# EAGLE design BPSD (EAGLE 9.2.2)
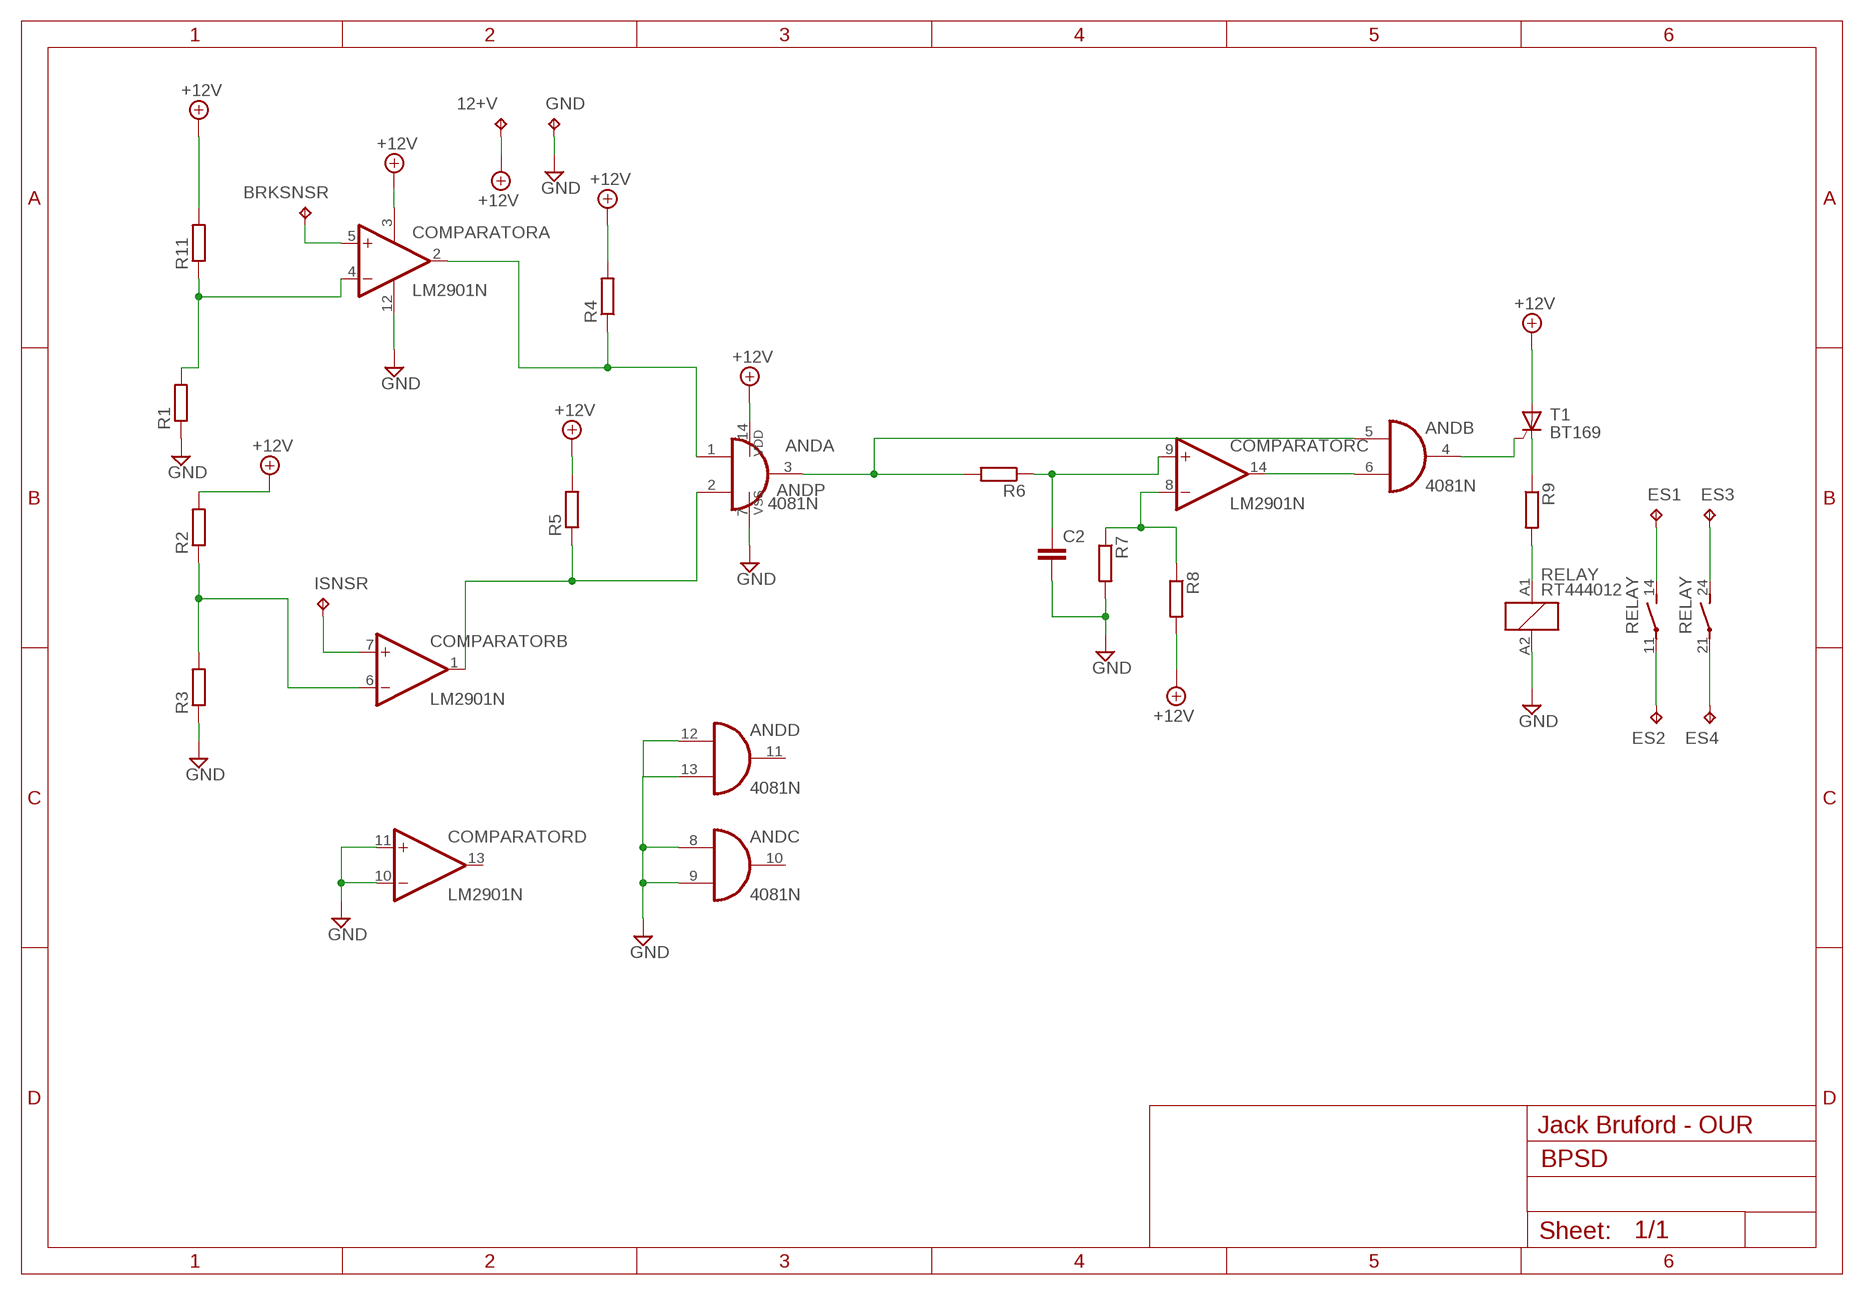
[diagram p0: schematic, sheet 1]

## Parts
12+V  TPPAD1-13  [P1-13]
AND  4081N  [DIL14]
BRKSNSR  TPPAD1-13  [P1-13]
C2  C-EU050-024X044  [C050-024X044]
COMPARATOR  LM2901N  [DIL14]
ES1  TPPAD1-13  [P1-13]
ES2  TPPAD1-13  [P1-13]
ES3  TPPAD1-13  [P1-13]
ES4  TPPAD1-13  [P1-13]
GND  TPPAD1-13  [P1-13]
ISNSR  TPPAD1-13  [P1-13]
R1  R-EU_0207/15  [0207/15]
R2  R-EU_0207/15  [0207/15]
R3  R-EU_0207/15  [0207/15]
R4  R-EU_0207/15  [0207/15]
R5  R-EU_0207/15  [0207/15]
R6  R-EU_0207/15  [0207/15]
R7  R-EU_0207/15  [0207/15]
R8  R-EU_0207/15  [0207/15]
R9  R-EU_0207/15  [0207/15]
R11  R-EU_0207/15  [0207/15]
RELAY  RT444012  [RT2N/O]
T1  BT169  [TO92-2]

## Nets
+12V: 12+V.TP AND.14(P:VDD) COMPARATOR.3(P:V+) R2.2 R4.2 R5.2 R8.2 R11.2 T1.A
GND: AND.7(P:VSS) AND.8(C:I0) AND.9(C:I1) AND.12(D:I0) AND.13(D:I1) C2.2 COMPARATOR.10(D:-IN) COMPARATOR.11(D:+IN) COMPARATOR.12(P:V-) GND.TP R1.1 R3.1 R7.2 RELAY.A2
N$1: COMPARATOR.4(A:-IN) R1.2 R11.1
N$2: AND.1(A:I0) COMPARATOR.2(A:OUT) R4.1
N$3: COMPARATOR.6(B:-IN) R2.1 R3.2
N$4: AND.2(A:I1) COMPARATOR.1(B:OUT) R5.1
N$5: COMPARATOR.8(C:-IN) R7.1 R8.1
N$6: AND.3(A:O) AND.5(B:I0) R6.2
N$7: C2.1 COMPARATOR.9(C:+IN) R6.1
N$8: AND.6(B:I1) COMPARATOR.14(C:OUT)
N$9: AND.4(B:O) T1.G
N$10: R9.1 T1.C
N$11: R9.2 RELAY.A1
N$12: BRKSNSR.TP COMPARATOR.5(A:+IN)
N$13: COMPARATOR.7(B:+IN) ISNSR.TP
N$14: ES1.TP RELAY.14(2:S)
N$15: ES2.TP RELAY.11(2:P)
N$16: ES3.TP RELAY.24(3:S)
N$17: ES4.TP RELAY.21(3:P)
Unconnected: AND.10(C:O) AND.11(D:O) COMPARATOR.13(D:OUT)

## Notes on the sheet
- Jack Bruford - OUR

## Library data of the parts
12+V BRKSNSR ES1-ES4 GND ISNSR = testpad:TP: Test pad
AND = 40xx:4081: Quad 2-input AND
C2 = rcl:C-EU: CAPACITOR, European symbol; SPICEPREFIX: C
COMPARATOR = linear:LM2901: COMPARATOR
R1-R9 R11 = rcl:R-EU_: RESISTOR, European symbol; SPICEPREFIX: R
RELAY = relay:RT44?*: Power PCB Relay SCHRACK 2 pole 8 A, DC and AC-coil Source: http://www.schrack.com/.. 5842.pdf; OC_FARNELL: unknown; OC_NEWARK: unknown
T1 = triac:BT169: THYRISTOR

## Board
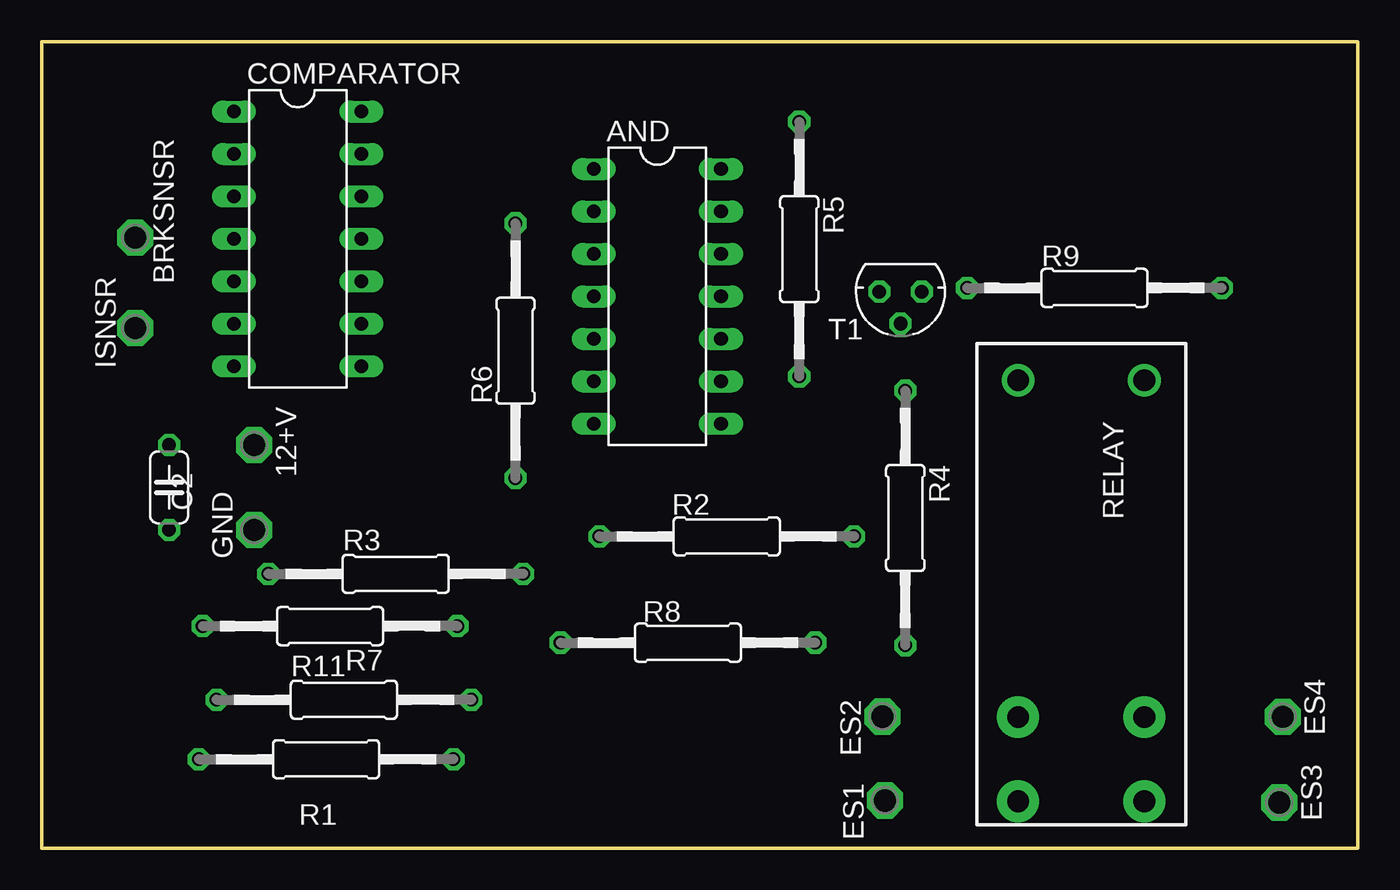
[diagram p1: board, top side]
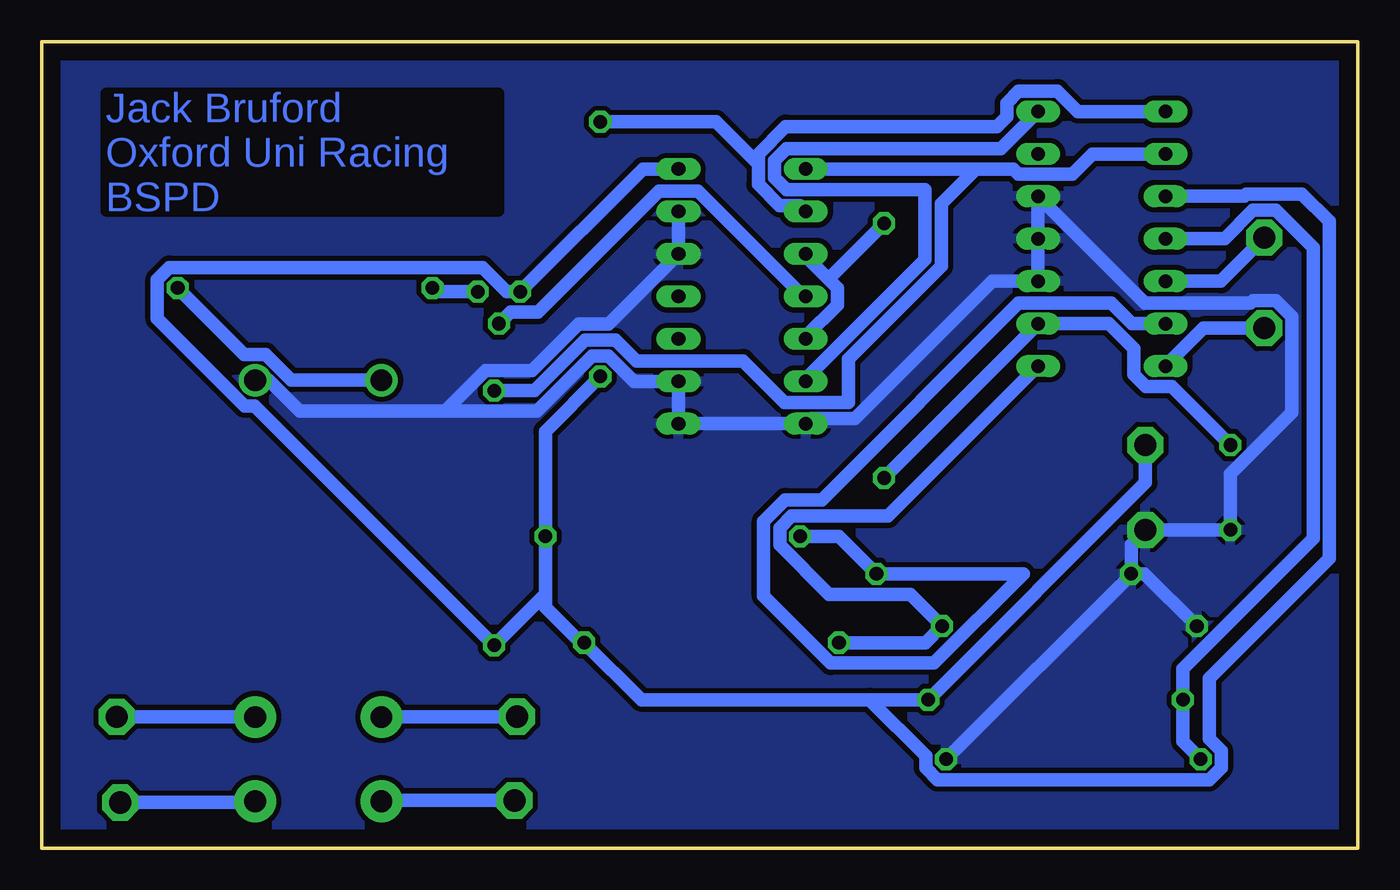
[diagram p2: board, bottom side, seen from below]

Size 78.74 x 48.26 mm. Coordinates in mm from the lower left corner, seen from the top.
Outline: 78.74,0 78.74,48.26 0,48.26 0,0 78.74,0
Copper layers (1*16): Top 0.035mm / dielectric 1.5mm / Bottom 0.035mm
Design rules "default": minimum track width 6mil, minimum drill 0.35mm, track to track 6mil, track to pad 6mil, pad to pad 6mil, via to via 6mil, smd to smd 6mil, copper to edge 40mil, drill to drill 6mil, minimum pad ring 10mil, minimum via ring 8mil, stop-mask expansion 4mil, vias tented up to drill 0mil, thermal gap 10mil

### Footprints (pad centres in the part's own frame; a part is rotated, then mirrored left to right if it is on the bottom)
P1-13 = drill 1.321 pad 2.159 octagon: TP 0,0
DIL14 = drill 0.813 long: 1 -7.62,-3.81; 2 -5.08,-3.81; 3 -2.54,-3.81; 4 0,-3.81; 5 2.54,-3.81; 6 5.08,-3.81; 7 7.62,-3.81; 8 7.62,3.81; 9 5.08,3.81; 10 2.54,3.81; 11 0,3.81; 12 -2.54,3.81; 13 -5.08,3.81; 14 -7.62,3.81
C050-024X044 = drill 0.813 octagon: 1 -2.54,0; 2 2.54,0
0207/15 = drill 0.813 octagon: 1 -7.62,0; 2 7.62,0
RT2N/O = drill 1.3 pad 2.5: 11 7.56,-3.78; 14 12.6,-3.78; 21 7.56,3.78; 24 12.6,3.78 | drill 1.3: A1 -12.6,-3.78; A2 -12.6,3.78
TO92-2 = drill 0.813 octagon: A 1.27,0; C -1.27,0; G 0,1.905

### Placement (x,y rotation side)
12+V  12.7,24.13 270 top
AND  36.83,33.02 270 top
BRKSNSR  5.59,36.53 0 top
C2  7.62,21.59 270 top
COMPARATOR  15.31,36.47 270 top
ES1  50.46,2.85 270 top
ES2  50.29,7.87 270 top
ES3  74.06,2.73 270 top
ES4  74.25,7.85 270 top
GND  12.7,19.05 270 top
ISNSR  5.58,31.12 0 top
R1  17.01,5.32 180 top
R2  40.99,18.66 0 top
R3  21.18,16.42 0 top
R4  51.67,19.76 270 top
R5  45.32,35.85 270 top
R6  28.34,29.77 90 top
R7  17.25,13.29 180 top
R8  38.66,12.3 0 top
R9  62.99,33.53 0 top
R11  18.08,8.88 0 top
RELAY  62.19,15.41 270 top
T1  51.38,33.3 180 top

### Tracks (layer width: path | path; a pad name or v marks a point on that pad's centre or on a via)
+12V
  Bottom 0.813: 29.21,8.88 42.87,8.88 R8.2 46.38,12.2 48.6,14.42 R2.2 | 29.21,8.88 R11.2 12.7,21.88 12+V.TP | AND.14 42.77,40.64 T1.A 50.93,33.3 52.38,34.75 71.11,34.75 71.83,34.04 71.83,31.69 66.61,26.47 66,26.47 R4.2 48.6,15.2 R2.2 | R5.2 48.6,24.95 R2.2 | 29.21,8.88 25.85,5.52 25.85,4.82 25.14,4.1 8.89,4.1 8.17,4.82 8.17,5.83 8.89,6.54 8.89,10.16 1.71,17.34 1.71,37.51 3.33,39.14 6.66,39.14 6.79,39.01 COMPARATOR.3
GND
  Bottom 0.813: R7.2 12.76,16.42 R3.1 | R1.1 13.56,16.39 R3.1 | COMPARATOR.12 12.72,32.61 6.41,32.61 6.26,32.76 4.9,32.76 3.94,31.8 3.94,26.08 7.62,22.41 C2.2 GND.TP 13.56,18.19 R3.1 | 19.12,38.85 COMPARATOR.12 | COMPARATOR.12 COMPARATOR.11 COMPARATOR.10 21.86,33.93 30.08,25.7 32.72,25.7 AND.7 AND.8 AND.9 43.31,27.94 44.82,29.45 45.83,29.45 49.12,26.16 54.61,26.16 | AND.13 AND.12 44.82,31.38 46.63,31.38 49.41,28.6 52.17,28.6 52.89,27.88 54.61,26.16 | RELAY.A2 65.17,28.01 63.32,26.16 54.61,26.16 | 54.61,26.16
  pour Bottom (isolate 0.305): 78.74,0 78.74,48.26 0,48.26 0,0
N$1
  Bottom 0.813: R1.2 10.46,6.39 R11.1 10.46,10.73 2.67,18.52 2.67,35.94 4.91,38.17 6.26,38.17 7.97,36.47 COMPARATOR.4
N$2
  Bottom 0.813: 22.86,40.64 20.6,40.64 20.29,40.33 17.07,40.33 15.88,41.53 11.52,41.53 COMPARATOR.2 | 22.86,40.64 AND.1 | R4.1 49.26,27.38 46.23,30.41 44.42,30.41 43.16,29.16 36.78,29.16 34.29,26.67 30.48,26.67 30.48,29.27 24.93,34.83 24.93,38.58 22.86,40.64
N$3
  Bottom 0.813: R2.1 31.04,18.66 R3.2 20.01,16.42 25.36,11.08 31.55,11.08 35.55,15.08 35.55,19.56 34.27,20.84 32.06,20.84 20.29,32.61 14.73,32.61 13.51,31.39 COMPARATOR.6
N$4
  Bottom 0.813: COMPARATOR.1 16.74,44.09 17.96,45.31 20.29,45.31 21,44.59 21,43.77 21.59,43.18 34.23,43.18 35.87,41.55 35.87,40.95 | 35.87,40.95 38.39,43.47 R5.1 | AND.2 33.38,38.46 34.59,38.46 35.87,39.73 35.87,40.95
N$5
  Bottom 0.813: R8.1 25.86,12.3 R7.1 26.78,15.2 31.63,15.2 34.59,18.15 34.59,19.16 33.87,19.88 28.1,19.88 COMPARATOR.8
N$6
  Bottom 0.813: AND.3 33.02,35.41 31.68,34.06 | 31.68,34.06 31.14,33.52 31.14,32.52 33.02,30.64 AND.5 | R6.2 31.68,34.06
N$7
  Bottom 0.813: C2.1 11.12,27.63 12.67,27.63 13.38,28.34 13.38,29.89 14.88,31.39 COMPARATOR.9 19.12,31.37 R6.1
N$8
  Bottom 0.813: AND.6 33.02,28.09 25.89,35.23 25.89,39.42 34.19,39.42 34.9,40.13 34.9,41.15 34.19,41.86 21.35,41.86 COMPARATOR.14
N$9
  Bottom 0.813: T1.G 50.7,32.08 49.04,32.08 41.8,39.32 39.48,39.32 33.17,33.02 AND.4
N$10
  Bottom 0.813: T1.C 55.14,33.3 R9.1
N$11
  Bottom 0.813: RELAY.A1 63.8,28.01 65.34,29.54 66.62,29.54 R9.2
N$12
  Bottom 0.813: BRKSNSR.TP 8.19,33.93 COMPARATOR.5
N$13
  Bottom 0.813: ISNSR.TP 9.23,31.12 COMPARATOR.7
N$14
  Bottom 0.813: ES1.TP 58.37,2.85 RELAY.14
N$15
  Bottom 0.813: ES2.TP 50.32,7.85 RELAY.11
N$16
  Bottom 0.813: ES3.TP 66.05,2.73 RELAY.24
N$17
  Bottom 0.813: RELAY.21 ES4.TP

### Text on the board
Bottom: Jack Bruford / Oxford Uni Racing / BSPD